# Altium schematic sheet TPS61088Q Boost Converter.SchDoc
size Letter
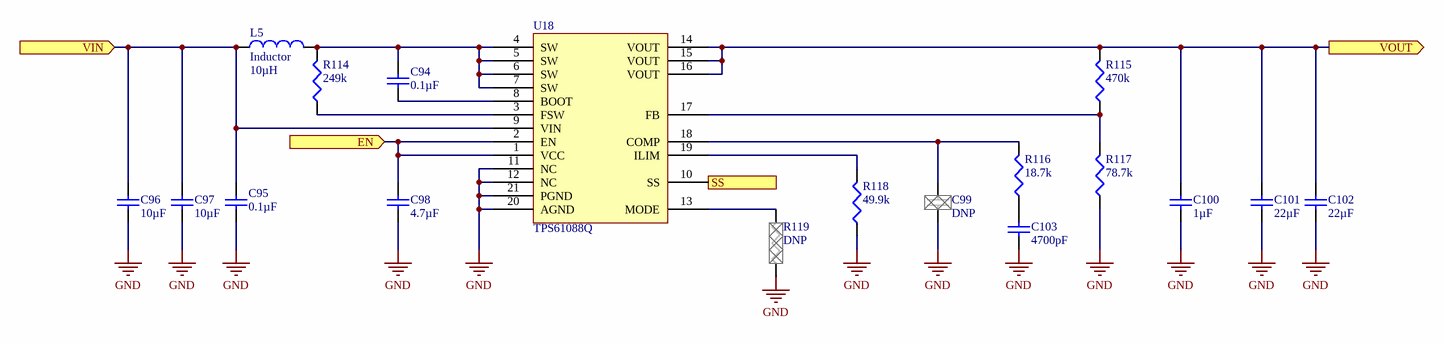
[diagram p0: TPS61088Q Boost Converter.SchDoc]

## Parts
C94  value 0.1µF  [TY-0402V]  (hidden comment: Cap)
C95  value 0.1µF  [TY-0402V]  (hidden comment: Cap)
C96  value 10µF  [TY-1210M]  (hidden comment: Cap)
C97  value 10µF  [TY-1210M]  (hidden comment: Cap)
C98  value 4.7µF  [TY-0603A]  (hidden comment: Cap)
C99  DNP  [TDK-CGA2B]  (no BOM)
C100  value 1µF  [TY-0603A]  (hidden comment: Cap)
C101  value 22µF  [TY-1210M]  (hidden comment: Cap)
C102  value 22µF  [TY-1210M]  (hidden comment: Cap)
C103  value 4700pF  [TDK-CGA2B]  (hidden comment: Cap)
L5  Inductor  value 10µH  [KEM-MPXV1D1264L100]
R114  value 249k  [PANA-ERJ2R]  (hidden comment: Res3)
R115  value 470k  [PANA-ERJ2R]  (hidden comment: Res3)
R116  value 18.7k  [PANA-ERJ2R]  (hidden comment: Res3)
R117  value 78.7k  [PANA-ERJ2R]  (hidden comment: Res3)
R118  value 49.9k  [PANA-ERJ2R]  (hidden comment: Res3)
R119  DNP  [PANA-ERJ2G]  (no BOM)
U18  TPS61088Q  [TI-RHL0020A]

## Ports
EN (in), SS (in), VIN (in), VOUT (out)

## Nets
GND: C95.1 C96.1 C97.1 C98.1 C99.1 C100.1 C101.1 C102.1 C103.1 R117.1 R118.1 R119.1 U18.11(NC) U18.12(NC) U18.20(AGND) U18.21(PGND)
EN: C98.2 U18.1(VCC) U18.2(EN) ; port EN
SS: U18.10(SS) ; port SS
VIN: C95.2 C96.2 C97.2 L5.1 U18.9(VIN) ; port VIN
VOUT: C100.2 C101.2 C102.2 R115.2 U18.14(VOUT) U18.15(VOUT) U18.16(VOUT) ; port VOUT
NetC94_1: C94.1 U18.8(BOOT)
NetC94_2: C94.2 L5.2 R114.2 U18.4(SW) U18.5(SW) U18.6(SW) U18.7(SW)
NetC99_2: C99.2 R116.2 U18.18(COMP)
NetC103_2: C103.2 R116.1
NetR114_1: R114.1 U18.3(FSW)
NetR115_1: R115.1 R117.2 U18.17(FB)
NetR118_2: R118.2 U18.19(ILIM)
NetR119_2: R119.2 U18.13(MODE)

## Notes on the sheet
- (the "License"); you may not use or redistribute this file except in compliance with the License. You
- This file and the information within it are licensed under the terms of the Apache License, Version 2.0
- Copyright
- Unless required by applicable law or agreed to in writing, content distributed under the License is
- distributed on an "AS IS" BASIS, WITHOUT WARRANTIES OR CONDITIONS OF ANY KIND,
- either express or implied. See the License for the specific language governing permissions and
- limitations under the License.
- may obtain a copy of the License at:
- http://www.apache.org/licenses/LICENSE-2.0
- Title
- Size:
- Date:
- Letter
- Number:
- Time:
- Revision:
- Sheet
- of
- University of Alberta
- Deptartment of Electrical
- and Computer Engineering
- Edmonton AB, Canada
- T6G 1H9
- File:

## Library data of the parts
C94 C95 = PC-TY-00262: CAP CER 0.1UF 50V X7R 0402; Manufacturer Part Number: UMK105B7104KVHF; Index: 262; Designator: C?; Tolerance: ±10%; Published: 2016-03-13; LatestRevisionDate: 2016-03-13; LatestRevisionNote: ...; PackageReference: 0402 (1005 Metric); Publisher: AlbertaSat; PackageDescription: Chip Capacitor, 2-Leads, Body 1.00x0.50mm, IPC Low Density; Part Number: PC-TY-00262; Supplier Part Number 1: 587-4330-1-ND; Supplier 1: Digi-key; Supplier Link: http://www.digikey.ca/product-search/en?keywords=587-4330-1-ND; Voltage-Rated: 50V; Temperature Coefficient: X7R; Application: Automotive
C96 C97 = PC-TY-00679: CAP CER 10UF 50V X7R 1210; Manufacturer Part Number: UMK325AB7106KM-T; Index: 679; Designator: C?; Tolerance: ±10%; Published: 2016-03-13; LatestRevisionDate: 2016-03-13; LatestRevisionNote: ...; PackageReference: 1210 (3225 Metric); Publisher: AlbertaSat; PackageDescription: Chip Capacitor, 2-Leads, Body 3.20x2.50mm, IPC Low Density; Part Number: PC-TY-00679; Supplier Part Number 1: 587-3167-1-ND; Supplier 1: Digi-key; Supplier Link: http://www.digikey.ca/product-search/en?keywords=587-3167-1-ND; Voltage-Rated: 50V; Temperature Coefficient: X7R; Application: General Purpose
C98 = PC-TY-00526: CAP CER 4.7UF 25V X5R 0603; Manufacturer Part Number: TMK107BBJ475KA-T; Index: 526; Designator: C?; Tolerance: ±10%; Published: 3/13/2016; LatestRevisionDate: 3/13/2016; LatestRevisionNote: ...; PackageReference: 0603 (1608 Metric); Publisher: AlbertaSat; PackageDescription: Chip Capacitor, 2-Leads, Body 1.60x0.80mm, IPC Low Density; Part Number: PC-TY-00526; Supplier Part Number 1: 587-4321-1-ND; Supplier 1: Digi-key; Supplier Link: http://www.digikey.ca/product-search/en?keywords=587-4321-1-ND; Voltage-Rated: 25V; Temperature Coefficient: X5R; Application: General Purpose
C99 = 991: Part Number: 991; Designator: C?; Value: DNP; Index: 991; Supplier 1: Digi-key; Publisher: AlbertaSat; Published: 3/16/2016; LatestRevisionDate: 3/16/2016; LatestRevisionNote: ...; PackageReference: 0402 (1005 Metric)
C100 = PC-TY-00404: CAP CER 1UF 50V X7R 0603; Manufacturer Part Number: UMK107AB7105KA-T; Index: 404; Designator: C?; Tolerance: ±10%; Published: 3/13/2016; LatestRevisionDate: 3/13/2016; LatestRevisionNote: ...; PackageReference: 0603 (1608 Metric); Publisher: AlbertaSat; PackageDescription: Chip Capacitor, 2-Leads, Body 1.60x0.80mm, IPC Low Density; Part Number: PC-TY-00404; Supplier Part Number 1: 587-3247-1-ND; Supplier 1: Digi-key; Supplier Link: http://www.digikey.ca/product-search/en?keywords=587-3247-1-ND; Voltage-Rated: 50V; Temperature Coefficient: X7R; Application: General Purpose
C101 C102 = PC-TY-00743: CAP CER 22UF 25V X7R 1210; Manufacturer Part Number: TMK325B7226KMHT; Index: 743; Designator: C?; Tolerance: ±20%; Published: 3/13/2016; LatestRevisionDate: 3/13/2016; LatestRevisionNote: ...; PackageReference: 1210 (3225 Metric); Publisher: AlbertaSat; PackageDescription: Chip Capacitor, 2-Leads, Body 3.20x2.50mm, IPC Low Density; Part Number: PC-TY-00743; Supplier Part Number 1: 587-4337-1-ND; Supplier 1: Digi-key; Supplier Link: http://www.digikey.ca/product-search/en?keywords=587-4337-1-ND; Voltage-Rated: 25V; Temperature Coefficient: X7R; Application: Automotive
C103 = PC-TDK-01714: CAP CER 4700PF 50V X8R 0402; Manufacturer Part Number: CGA2B2X8R1H472K050BA; Index: 1714; Designator: C?; Tolerance: ±10%; Published: 3/16/2016; LatestRevisionDate: 3/16/2016; LatestRevisionNote: ...; PackageReference: 0402 (1005 Metric); Publisher: AlbertaSat; PackageDescription: Radial Cap, Thru-Hole; 2 Leads; 0.3 in Pin Spacing; Part Number: PC-TDK-01714; Supplier Part Number 1: 445-5883-1-ND; Supplier 1: Digi-key; Supplier Link: http://www.digikey.ca/product-search/en?keywords=445-5883-1-ND; Voltage - Rated: 50V; Temperature Coefficient: X8R; Applications: Automotive
L5 = PL-KEM-03164: INDUCTOR AUTOMOTIVE 10 UH, 14A,; Manufacturer Part Number: MPXV1D1264L100; Code_IEC: 1005; Index: 3164; Designator: L?; Tolerance: ±20%; Published: 3/9/2020; LatestRevisionDate: 3/9/2020; LatestRevisionNote: ...; PackageReference: 0.520" L x 0.492" W (13.20mm x 12.50mm); Publisher: AlbertaSat; PackageDescription: Precision Wire Wound Inductor, 2-Leads, Body 13.20x12.50mm, IPC Low Density; Code_JEITA: 0402; Part Number: PL-KEM-03164; Supplier Part Number 1: 399-MPXV1D1264L100CT-ND; Supplier 1: Digi-key; Supplier Part Number 2: 80-MPXV1D1264L100; Supplier 2: Mouser; Supplier Link: #https://www.digikey.ca/products/en?keywords=399-MPXV1D1264L100CT-ND#
R114 = 19136: RES SMD 249K OHM 1% 1/10W 0402; Part Number: 19136; Manufacturer Part Number: ERJ-2RKF2493X; Designator: R?; Power: 0.1W, 1/10W; Temperature Coefficient: ±100ppm/°C; Published: 8-Jun-2000; LatestRevisionDate: 29-May-2009; LatestRevisionNote: IPC-7351 Footprint Added.; PackageReference: 0402 (1005 Metric); Publisher: Altium Limited; PackageDescription: Chip Resistor, 2-Leads, Body 1.00x0.50mm, IPC Low Density; Supplier Part Number 1: P249KLCT-ND; Supplier 1: Digi-Key; Supplier Link: http://www.digikey.ca/product-search/en?keywords=P249KLCT-ND; Tolerance: ±1%
R115 = 19407: RES SMD 470K OHM 1% 1/10W 0402; Part Number: 19407; Manufacturer Part Number: ERJ-2RKF4703X; Designator: R?; Power: 0.1W, 1/10W; Temperature Coefficient: ±100ppm/°C; Published: 8-Jun-2000; LatestRevisionDate: 29-May-2009; LatestRevisionNote: IPC-7351 Footprint Added.; PackageReference: 0402 (1005 Metric); Publisher: Altium Limited; PackageDescription: Chip Resistor, 2-Leads, Body 1.00x0.50mm, IPC Low Density; Supplier Part Number 1: P470KLCT-ND; Supplier 1: Digi-Key; Supplier Link: http://www.digikey.ca/product-search/en?keywords=P470KLCT-ND; Tolerance: ±1%
R116 = 17657: RES SMD 18.7K OHM 1% 1/10W 0402; Part Number: 17657; Manufacturer Part Number: ERJ-2RKF1872X; Designator: R?; Power: 0.1W, 1/10W; Temperature Coefficient: ±100ppm/°C; Published: 8-Jun-2000; LatestRevisionDate: 29-May-2009; LatestRevisionNote: IPC-7351 Footprint Added.; PackageReference: 0402 (1005 Metric); Publisher: Altium Limited; PackageDescription: Chip Resistor, 2-Leads, Body 1.00x0.50mm, IPC Low Density; Supplier Part Number 1: P18.7KLCT-ND; Supplier 1: Digi-Key; Supplier Link: http://www.digikey.ca/product-search/en?keywords=P18.7KLCT-ND; Tolerance: ±1%
R117 = 18602: RES SMD 78.7K OHM 1% 1/10W 0402; Part Number: 18602; Manufacturer Part Number: ERJ-2RKF7872X; Designator: R?; Power: 0.1W, 1/10W; Temperature Coefficient: ±100ppm/°C; Published: 8-Jun-2000; LatestRevisionDate: 29-May-2009; LatestRevisionNote: IPC-7351 Footprint Added.; PackageReference: 0402 (1005 Metric); Publisher: Altium Limited; PackageDescription: Chip Resistor, 2-Leads, Body 1.00x0.50mm, IPC Low Density; Supplier Part Number 1: P78.7KLCT-ND; Supplier 1: Digi-Key; Supplier Link: http://www.digikey.ca/product-search/en?keywords=P78.7KLCT-ND; Tolerance: ±1%
R118 = 18323: RES SMD 49.9K OHM 1% 1/10W 0402; Part Number: 18323; Manufacturer Part Number: ERJ-2RKF4992X; Designator: R?; Power: 0.1W, 1/10W; Temperature Coefficient: ±100ppm/°C; Published: 8-Jun-2000; LatestRevisionDate: 29-May-2009; LatestRevisionNote: IPC-7351 Footprint Added.; PackageReference: 0402 (1005 Metric); Publisher: Altium Limited; PackageDescription: Chip Resistor, 2-Leads, Body 1.00x0.50mm, IPC Low Density; Supplier Part Number 1: P49.9KLCT-ND; Supplier 1: Digi-Key; Supplier Link: http://www.digikey.ca/product-search/en?keywords=P49.9KLCT-ND; Tolerance: ±1%
R119 = 19766: Part Number: 19766; Designator: R?; Value: DNP; PackageReference: 0402 (1005 Metric); PackageDescription: Chip Resistor, 2-Leads, Body 1.00x0.50mm, IPC Low Density
U18 = 94: IC PWR MGMT SWITCHING REGULATOR; Part Number: 94; Manufacturer Part Number: TPS61088QRHLTQ1; Designator: U?; Supplier Part Number 2: TPS61088QRHLRQ1; Supplier 2: Texas Instruments; Supplier Part Number 1: 595-TPS61088QRHLTQ1; Supplier 1: Mouser; Supplier Link: #https://www.mouser.ca/ProductDetail/Texas-Instruments/TPS61088QRHLTQ1?qs=%2Fha2pyFadugGfwlG6tIeOBla0IZK8kKHj2%252BmBr6TE1HQ3YXctpPgVQ6mGbHAczHM#; PackageReference: 20-VQFN (3.5x4.5); Operating Temperature: -40°C ~ 125°C (TJ)